# EAGLE design CNC-PowerSwitch-2016-v0.95 (EAGLE 7.7.0)

## Sheet 1 of 3
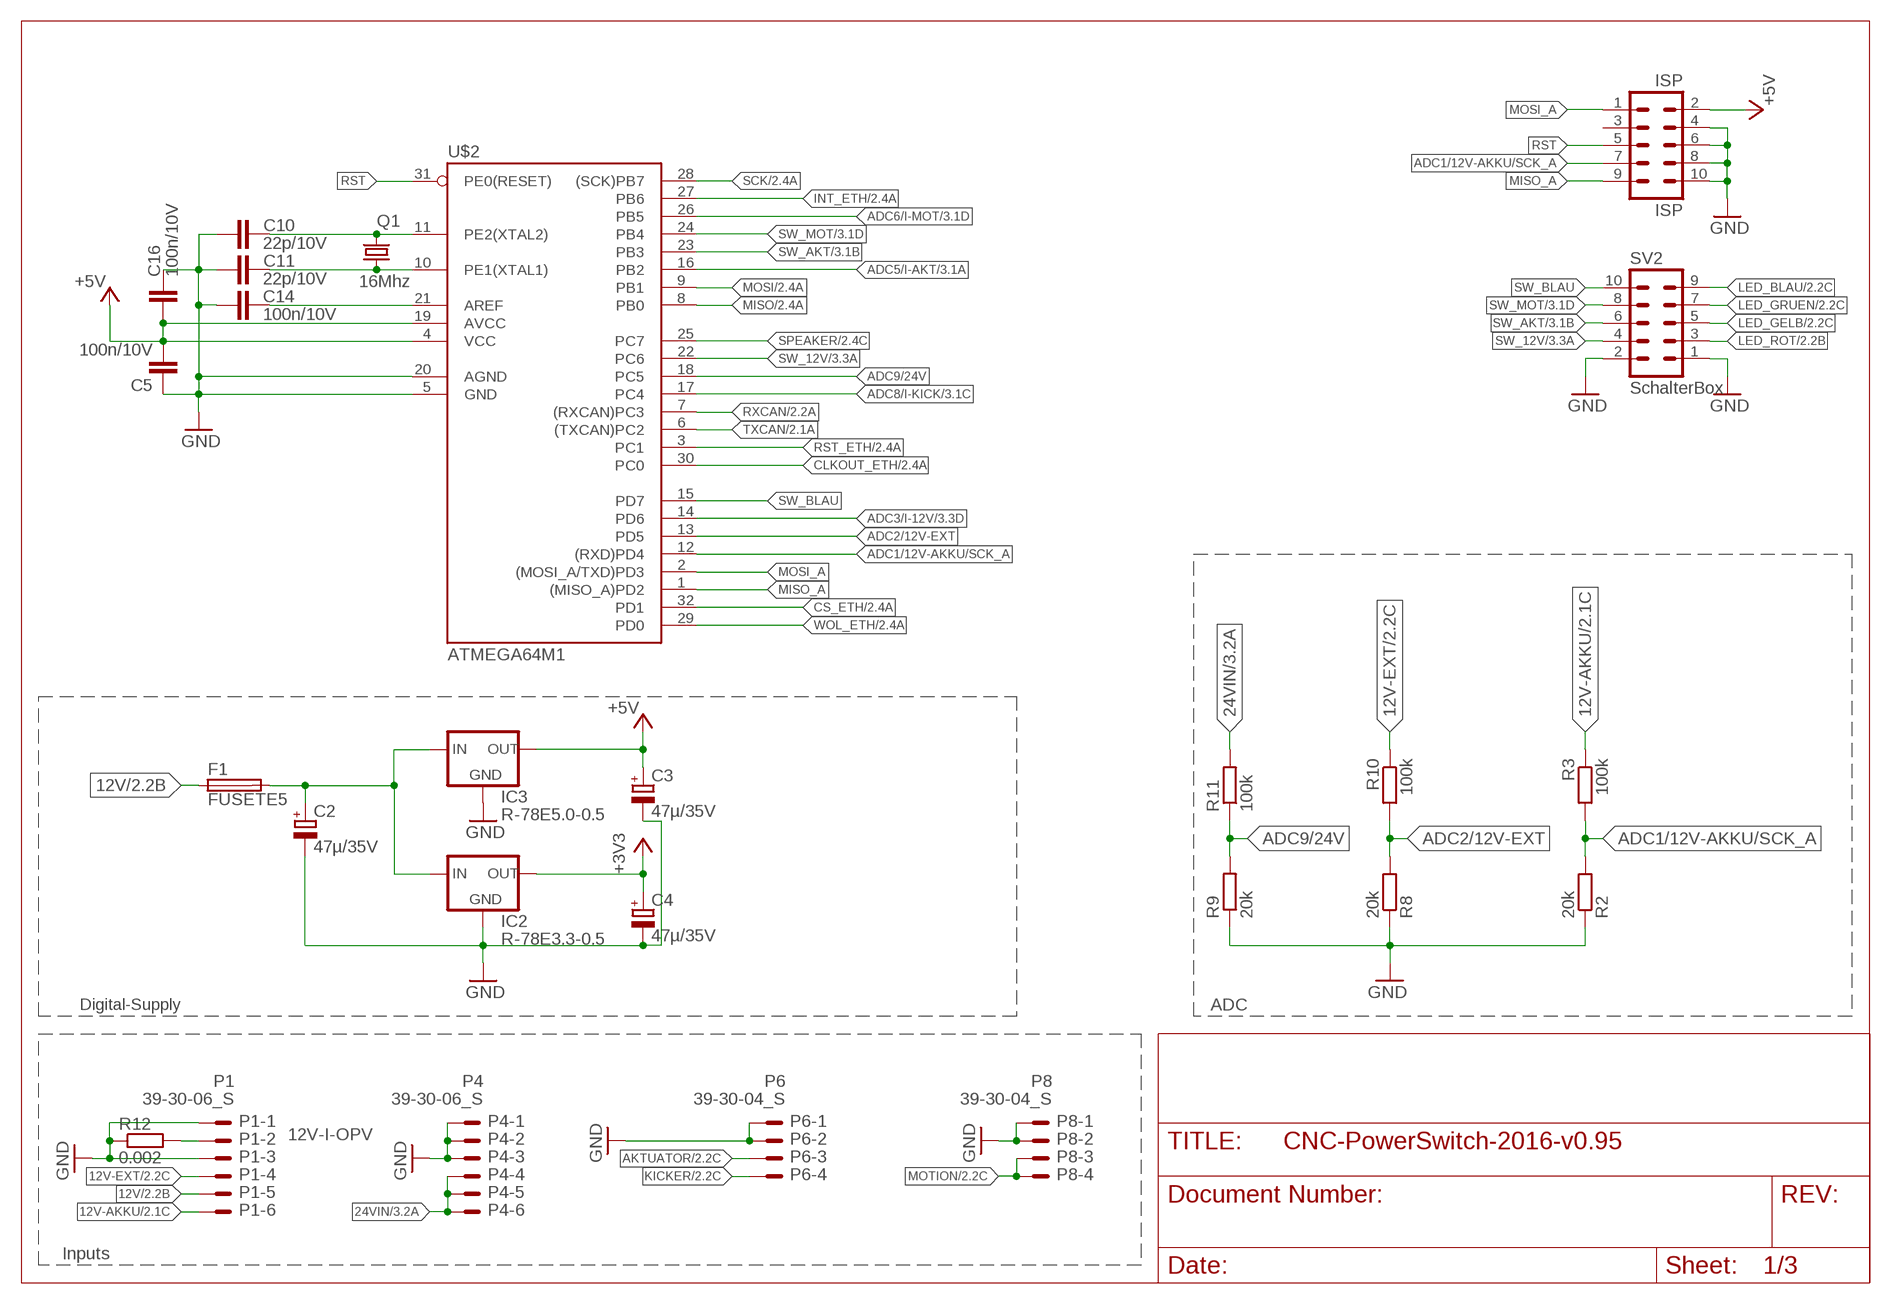
[diagram p0: schematic, sheet 1]

### Parts
C2  47µ/35V  CPOL-EUD  [PANASONIC_D]
C3  47µ/35V  CPOL-EUD  [PANASONIC_D]
C4  47µ/35V  CPOL-EUD  [PANASONIC_D]
C5  100n/10V  C-EUC0603  [C0603]
C10  22p/10V  C-EUC0603  [C0603]
C11  22p/10V  C-EUC0603  [C0603]
C14  100n/10V  C-EUC0603  [C0603]
C16  100n/10V  C-EUC0603  [C0603]
F1  FUSETE5  [TE5]
IC2  R-78E3.3-0.5  [SIP3]
IC3  R-78E5.0-0.5  [SIP3]
ISP  ISP  ML10  [ML10]
P1  39-30-06_S  [39-30-?06?]
P4  39-30-06_S  [39-30-?06?]
P6  39-30-04_S  [39-30-?04?]
P8  39-30-04_S  [39-30-?04?]
Q1  16Mhz  CRYSTALHC49UP  [HC49UP]
R2  20k  R-EU_R0805  [R0805]
R3  100k  R-EU_R0805  [R0805]
R8  20k  R-EU_R0805  [R0805]
R9  20k  R-EU_R0805  [R0805]
R10  100k  R-EU_R0805  [R0805]
R11  100k  R-EU_R0805  [R0805]
R12  0.002  R-EU_R2512  [R2512]
SV2  SchalterBox  ML10L  [ML10L]
U$2  ATMEGA64M1  [TQFP32-08]

### Nets
12V: F1.1 P1.5 ; also sheet 2,3
12V-AKKU: P1.6 R3.1 ; also sheet 2,3
12V-EXT: P1.4 R10.1 ; also sheet 2,3
12V-I-OPV: P1.2 R12.2 ; also sheet 3
24VIN: P4.4 P4.5 P4.6 R11.2 ; also sheet 3
+3V3: C4.+ IC2.3(OUT) ; also sheet 2
+5V: C3.+ C5.2 C16.1 IC3.3(OUT) ISP.2 U$2.4(VCC) U$2.19(AVCC) ; also sheet 2,3
ADC1/12V-AKKU/SCK_A: ISP.7 R2.2 R3.2 U$2.12((RXD)PD4)
ADC2/12V-EXT: R8.2 R10.2 U$2.13(PD5)
ADC3/I-12V: U$2.14(PD6) ; also sheet 3
ADC5/I-AKT: U$2.16(PB2) ; also sheet 3
ADC6/I-MOT: U$2.26(PB5) ; also sheet 3
ADC8/I-KICK: U$2.17(PC4) ; also sheet 3
ADC9/24V: R9.2 R11.1 U$2.18(PC5)
AKTUATOR: P6.3 ; also sheet 2,3
CLKOUT_ETH: U$2.30(PC0) ; also sheet 2
CS_ETH: U$2.32(PD1) ; also sheet 2
GND: C2.- C3.- C4.- C5.1 C10.1 C11.1 C14.1 C16.2 IC2.2(GND) IC3.2(GND) ISP.4 ISP.6 ISP.8 ISP.10 P1.1 P1.3 P4.1 P4.2 P4.3 P6.1 P6.2 P8.1 P8.2 R2.1 R8.1 R9.1 R12.1 SV2.1 SV2.2 U$2.5(GND) U$2.20(AGND) ; also sheet 2,3
INT_ETH: U$2.27(PB6) ; also sheet 2
KICKER: P6.4 ; also sheet 2,3
LED_BLAU: SV2.9 ; also sheet 2
LED_GELB: SV2.5 ; also sheet 2
LED_GRUEN: SV2.7 ; also sheet 2
LED_ROT: SV2.3 ; also sheet 2
MISO: U$2.8(PB0) ; also sheet 2
MISO_A: ISP.9 U$2.1((MISO_A)PD2)
MOSI: U$2.9(PB1) ; also sheet 2
MOSI_A: ISP.1 U$2.2((MOSI_A/TXD)PD3)
MOTION: P8.3 P8.4 ; also sheet 2,3
N$10: C10.2 Q1.2 U$2.11(PE2(XTAL2))
N$11: C11.2 Q1.1 U$2.10(PE1(XTAL1))
N$13: C14.2 U$2.21(AREF)
N$22: C2.+ F1.2 IC2.1(IN) IC3.1(IN)
RST: ISP.5 U$2.31(PE0(RESET))
RST_ETH: U$2.3(PC1) ; also sheet 2
RXCAN: U$2.7((RXCAN)PC3) ; also sheet 2
SCK: U$2.28((SCK)PB7) ; also sheet 2
SPEAKER: U$2.25(PC7) ; also sheet 2
SW_12V: SV2.4 U$2.22(PC6) ; also sheet 3
SW_AKT: SV2.6 U$2.23(PB3) ; also sheet 3
SW_BLAU: SV2.10 U$2.15(PD7)
SW_MOT: SV2.8 U$2.24(PB4) ; also sheet 3
TXCAN: U$2.6((TXCAN)PC2) ; also sheet 2
WOL_ETH: U$2.29(PD0) ; also sheet 2
Unconnected: ISP.3

### Notes on the sheet
- Digital-Supply | ADC
- Inputs

## Sheet 2 of 3
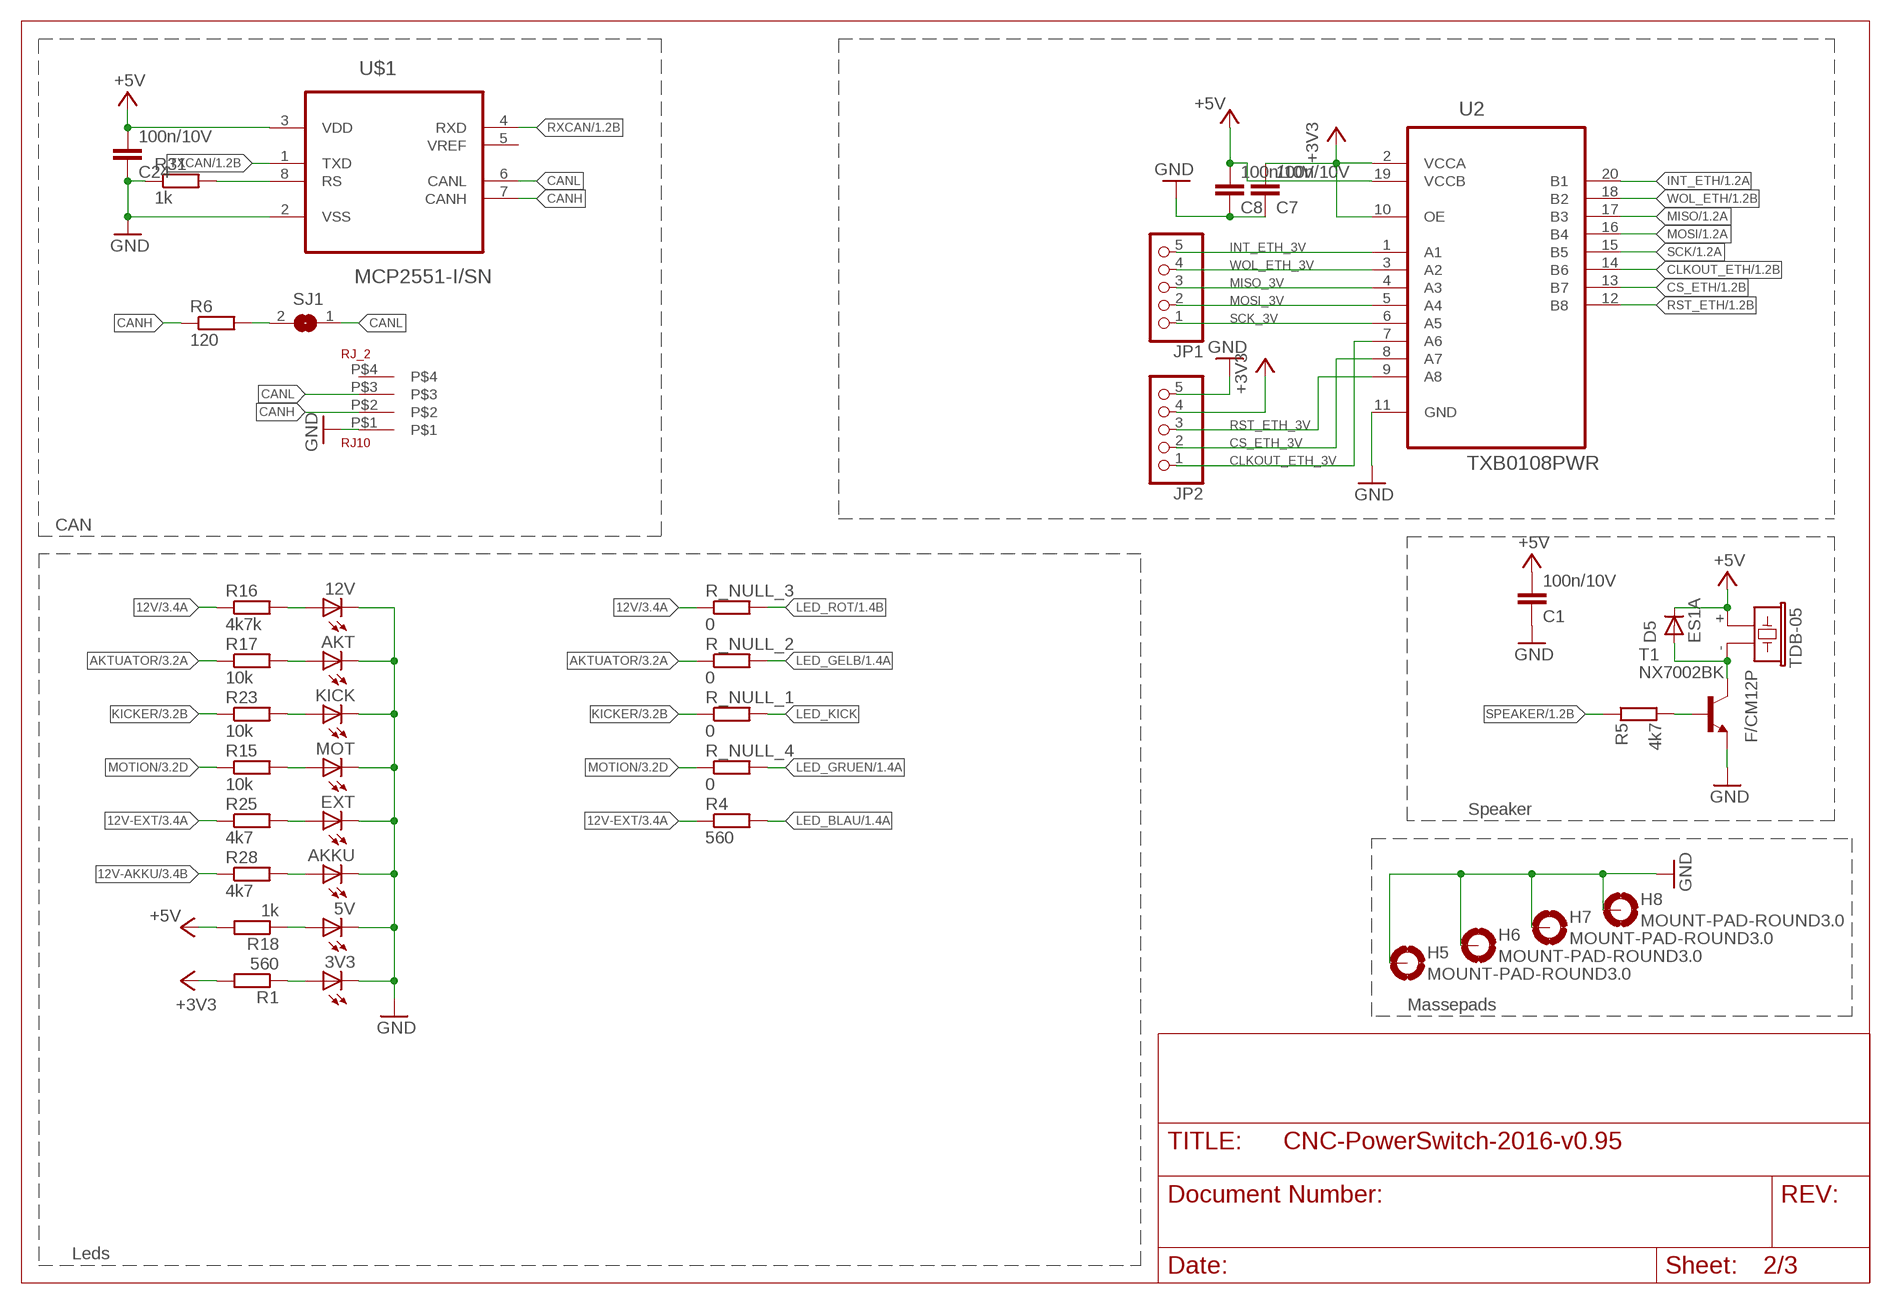
[diagram p1: schematic, sheet 2]

### Parts
3V3  LEDCHIPLED_0805  [CHIPLED_0805]
5V  LEDCHIPLED_0805  [CHIPLED_0805]
12V  LEDCHIPLED_0805  [CHIPLED_0805]
AKKU  LEDCHIPLED_0805  [CHIPLED_0805]
AKT  LEDCHIPLED_0805  [CHIPLED_0805]
C1  100n/10V  C-EUC0603  [C0603]
C7  100n/10V  C-EUC0603  [C0603]
C8  100n/10V  C-EUC0603  [C0603]
C24  100n/10V  C-EUC0603  [C0603]
D5  ES1A  GF1  [SMA-DO214AC]
EXT  LEDCHIPLED_0805  [CHIPLED_0805]
H5  MOUNT-PAD-ROUND3.0  [3,0-PAD]
H6  MOUNT-PAD-ROUND3.0  [3,0-PAD]
H7  MOUNT-PAD-ROUND3.0  [3,0-PAD]
H8  MOUNT-PAD-ROUND3.0  [3,0-PAD]
JP1  PINHD-1X5  [1X05]
JP2  PINHD-1X5  [1X05]
KICK  LEDCHIPLED_0805  [CHIPLED_0805]
MOT  LEDCHIPLED_0805  [CHIPLED_0805]
R1  560  R-EU_R0805  [R0805]
R4  560  R-EU_R0805  [R0805]
R5  4k7  R-EU_R0805  [R0805]
R6  120  R-EU_M0805  [M0805]
R15  10k  R-EU_R0805  [R0805]
R16  4k7k  R-EU_R0805  [R0805]
R17  10k  R-EU_R0805  [R0805]
R18  1k  R-EU_R0805  [R0805]
R23  10k  R-EU_R0805  [R0805]
R25  4k7  R-EU_R0805  [R0805]
R28  4k7  R-EU_R0805  [R0805]
R31  1k  R-EU_R0805  [R0805]
R_NULL_1  0  R-EU_R0402  [R0402]
R_NULL_2  0  R-EU_R0402  [R0402]
R_NULL_3  0  R-EU_R0402  [R0402]
R_NULL_4  0  R-EU_R0402  [R0402]
RJ_2  RJ10  [RJ10]
SJ1  SJ  [SJ]
T1  NX7002BK  BC849  [SOT23]
TDB-05  F/CM12P  [F/CM12P]
U2  TXB0108PWR  [SOP65P640X120-20N]
U$1  MCP2551-I/SN  [SOIC127P600X175-8N]

### Nets
12V: R16.1 R_NULL_3.1 ; also sheet 1,3
12V-AKKU: R28.1 ; also sheet 1,3
12V-EXT: R4.1 R25.1 ; also sheet 1,3
+3V3: C7.2 JP2.4 R1.2 U2.2(VCCA) U2.10(OE) ; also sheet 1
+5V: C1.2 C8.2 C24.2 D5.K(C) R18.2 TDB-05.+ U2.19(VCCB) U$1.3(VDD) ; also sheet 1,3
AKTUATOR: R17.1 R_NULL_2.1 ; also sheet 1,3
CANH: R6.1 RJ_2.P$2 U$1.7(CANH)
CANL: RJ_2.P$3 SJ1.1 U$1.6(CANL)
CLKOUT_ETH: U2.14(B6) ; also sheet 1
CLKOUT_ETH_3V: JP2.1 U2.7(A6)
CS_ETH: U2.13(B7) ; also sheet 1
CS_ETH_3V: JP2.2 U2.8(A7)
GND: 3V3.C 5V.C 12V.C AKKU.C AKT.C C1.1 C7.1 C8.1 C24.1 EXT.C H5.B3,0(MOUNT) H6.B3,0(MOUNT) H7.B3,0(MOUNT) H8.B3,0(MOUNT) JP2.5 KICK.C MOT.C R31.1 RJ_2.P$1 T1.2(E) U2.11(GND) U$1.2(VSS) ; also sheet 1,3
INT_ETH: U2.20(B1) ; also sheet 1
INT_ETH_3V: JP1.5 U2.1(A1)
KICKER: R23.1 R_NULL_1.1 ; also sheet 1,3
LED_BLAU: R4.2 ; also sheet 1
LED_GELB: R_NULL_2.2 ; also sheet 1
LED_GRUEN: R_NULL_4.2 ; also sheet 1
LED_KICK: R_NULL_1.2
LED_ROT: R_NULL_3.2 ; also sheet 1
MISO: U2.17(B3) ; also sheet 1
MISO_3V: JP1.3 U2.4(A3)
MOSI: U2.16(B4) ; also sheet 1
MOSI_3V: JP1.2 U2.5(A4)
MOTION: R15.1 R_NULL_4.1 ; also sheet 1,3
N$1: R5.2 T1.1(B)
N$3: EXT.A R25.2
N$4: KICK.A R23.2
N$5: 3V3.A R1.1
N$6: R31.2 U$1.8(RS)
N$7: R6.2 SJ1.2
N$20: D5.A T1.3(C) TDB-05.-
N$24: AKKU.A R28.2
N$102: 12V.A R16.2
N$104: AKT.A R17.2
N$106: MOT.A R15.2
N$108: 5V.A R18.1
RST_ETH: U2.12(B8) ; also sheet 1
RST_ETH_3V: JP2.3 U2.9(A8)
RXCAN: U$1.4(RXD) ; also sheet 1
SCK: U2.15(B5) ; also sheet 1
SCK_3V: JP1.1 U2.6(A5)
SPEAKER: R5.1 ; also sheet 1
TXCAN: U$1.1(TXD) ; also sheet 1
WOL_ETH: U2.18(B2) ; also sheet 1
WOL_ETH_3V: JP1.4 U2.3(A2)
Unconnected: RJ_2.P$4 U$1.5(VREF)

### Notes on the sheet
- CAN
- Speaker
- Massepads
- Leds

## Sheet 3 of 3
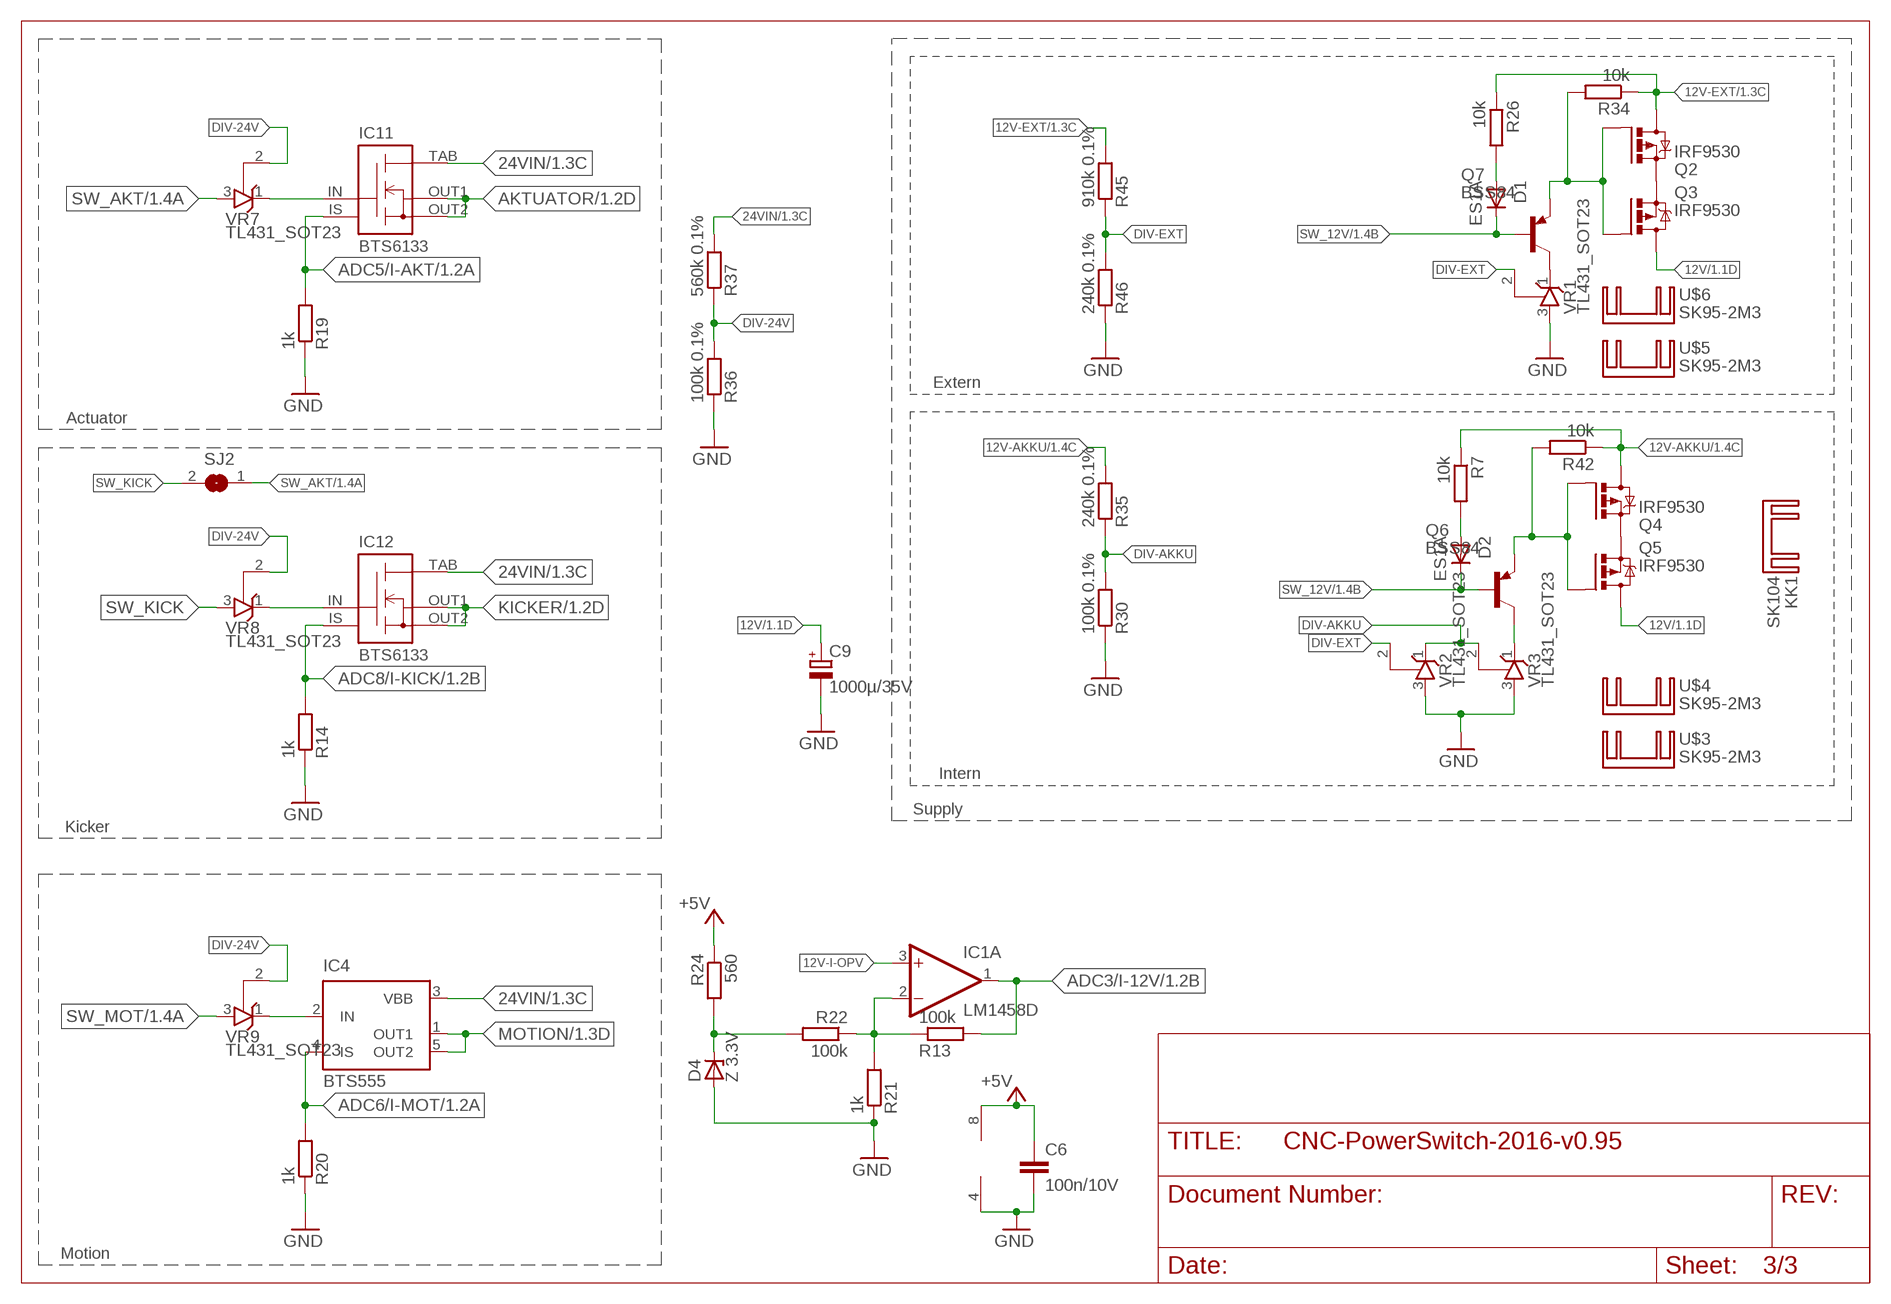
[diagram p2: schematic, sheet 3]

### Parts
C6  100n/10V  C-EUC0603  [C0603]
C9  1000µ/35V  CPOL-EUE5-10.5  [E5-10,5]
D1  ES1A  GF1  [SMA-DO214AC]
D2  ES1A  GF1  [SMA-DO214AC]
D4  Z 3.3V  ZENER-DIODESOT23  [SOT23]
IC1  LM1458D  [SO08]
IC4  BTS555  [TO220-51]
IC11  BTS6133  [TO252-51]
IC12  BTS6133  [TO252-51]
KK1  SK104  [SK104]
Q2  IRF9530  [TO220BV]
Q3  IRF9530  [TO220BV]
Q4  IRF9530  [TO220BV]
Q5  IRF9530  [TO220BV]
Q6  BSS84  BC858ALT1SMD  [SOT23-BEC]
Q7  BSS84  BC858ALT1SMD  [SOT23-BEC]
R7  10k  R-EU_R0805  [R0805]
R13  100k  R-EU_R0805  [R0805]
R14  1k  R-EU_R0805  [R0805]
R19  1k  R-EU_R0805  [R0805]
R20  1k  R-EU_R0805  [R0805]
R21  1k  R-EU_R0805  [R0805]
R22  100k  R-EU_R0805  [R0805]
R24  560  R-EU_R0805  [R0805]
R26  10k  R-EU_R0805  [R0805]
R30  100k 0.1%  R-EU_R0805  [R0805]
R34  10k  R-EU_R0805  [R0805]
R35  240k 0.1%  R-EU_R0805  [R0805]
R36  100k 0.1%  R-EU_R0805  [R0805]
R37  560k 0.1%  R-EU_R0805  [R0805]
R42  10k  R-EU_R0805  [R0805]
R45  910k 0.1%  R-EU_R0805  [R0805]
R46  240k 0.1%  R-EU_R0805  [R0805]
SJ2  SJ  [SJ]
U$3  SK95-2M3  [SK95-2M3]
U$4  SK95-2M3  [SK95-2M3]
U$5  SK95-2M3  [SK95-2M3]
U$6  SK95-2M3  [SK95-2M3]
VR1  TL431_SOT23  [SOT23]
VR2  TL431_SOT23  [SOT23]
VR3  TL431_SOT23  [SOT23]
VR7  TL431_SOT23  [SOT23]
VR8  TL431_SOT23  [SOT23]
VR9  TL431_SOT23  [SOT23]

### Nets
12V: C9.+ Q3.D Q5.D ; also sheet 1,2
12V-AKKU: Q4.D R7.1 R35.2 R42.1 ; also sheet 1,2
12V-EXT: Q2.D R26.1 R34.1 R45.2 ; also sheet 1,2
12V-I-OPV: IC1.3(A:+IN) ; also sheet 1
24VIN: IC4.3(VBB) IC11.TAB(VBB) IC12.TAB(VBB) R37.2 ; also sheet 1
+5V: C6.1 IC1.8(P:V+) R24.1 ; also sheet 1,2
ADC3/I-12V: IC1.1(A:OUT) R13.2 ; also sheet 1
ADC5/I-AKT: IC11.IS R19.2 ; also sheet 1
ADC6/I-MOT: IC4.4(IS) R20.2 ; also sheet 1
ADC8/I-KICK: IC12.IS R14.2 ; also sheet 1
AKTUATOR: IC11.OUT1(OUT) IC11.OUT2(OUT) ; also sheet 1,2
DIV-24V: R36.2 R37.1 VR7.2(R) VR8.2(R) VR9.2(R)
DIV-AKKU: R30.2 R35.1 VR2.1(C) VR3.2(R)
DIV-EXT: R45.1 R46.2 VR1.2(R) VR2.2(R)
GND: C6.2 C9.- D4.1(A) IC1.4(P:V-) R14.1 R19.1 R20.1 R21.1 R30.1 R36.1 R46.1 VR1.3(A) VR2.3(A) VR3.3(A) ; also sheet 1,2
KICKER: IC12.OUT1(OUT) IC12.OUT2(OUT) ; also sheet 1,2
MOTION: IC4.1(OUT1) IC4.5(OUT2) ; also sheet 1,2
N$2: Q7.C VR1.1(C)
N$8: Q6.C VR3.1(C)
N$9: D2.A R7.2
N$12: D1.A R26.2
N$25: IC1.2(A:-IN) R13.1 R21.2 R22.1
N$26: D4.3(C) R22.2 R24.2
N$28: Q2.S Q3.S
N$30: Q4.G Q5.G Q6.E R42.2
N$31: Q4.S Q5.S
N$36: IC12.IN VR8.1(C)
N$37: IC4.2(IN) VR9.1(C)
N$40: IC11.IN VR7.1(C)
N$49: Q2.G Q3.G Q7.E R34.2
SW_12V: D1.K(C) D2.K(C) Q6.B Q7.B ; also sheet 1
SW_AKT: SJ2.1 VR7.3(A) ; also sheet 1
SW_KICK: SJ2.2 VR8.3(A)
SW_MOT: VR9.3(A) ; also sheet 1
Unconnected: IC1.5(B:+IN) IC1.6(B:-IN) IC1.7(B:OUT)

### Notes on the sheet
- Extern
- Actuator
- Intern
- Supply
- Kicker
- Motion

## Library data of the parts
3V3 5V 12V AKKU AKT EXT KICK MOT = led:LED: LED OSRAM: - CHIPLED LG R971, LG N971, LY N971, LG Q971, LY Q971, LO R971, LY R971 LH N974, LH R974 LS Q976, LO Q976, LY Q976 LO Q996 - Hyper CHIPLED LW Q18S LB Q993, LB Q99A, LB R99A - SideLED LS A670, LO A670, LY A670, LG A670, LP A670 LB A673, LV A673, LT A673, LW A673 LH A674 LY A675 LS A676, LA A676, LO A676, LY A676, LW A676 LS A679, LY A679, LG A679 - Hyper Micro SIDELED® LS Y876, LA Y876, LO Y876, LY Y876 LT Y87S - SmartLED LW L88C, LW L88S LB L89C, LB L89S, LG L890 LS L89K, LO L89K, LY L89K LS L896, LA L896, LO L896, LY L896 - TOPLED LS T670, LO T670, LY T670, LG T670, LP T670 LSG T670, LSP T670, LSY T670, LOP T670, LYG T670 LG T671, LOG T671, LSG T671 LB T673, LV T673, LT T673, LW T673 LH T674 LS T676, LA T676, LO T676, LY T676, LB T676, LH T676, LSB T676, LW T676 LB T67C, LV T67C, LT T67C, LS T67K, LO T67K, LY T67K, LW E67C LS E67B, LA E67B, LO E67B, LY E67B, LB E67C, LV E67C, LT E67C LW T67C LS T679, LY T679, LG T679 LS T770, LO T770, LY T770, LG T770, LP T770 LB T773, LV T773, LT T773, LW T773 LH T774 LS E675, LA E675, LY E675, LS T675 LS T776, LA T776, LO T776, LY T776, LB T776 LHGB T686 LT T68C, LB T68C - Hyper Mini TOPLED® LB M676 - Mini TOPLED Santana® LG M470 LS M47K, LO M47K, LY M47K Source: http://www.osram.convergy.de LUXEON: - LUMILED® LXK2-PW12-R00, LXK2-PW12-S00, LXK2-PW14-U00, LXK2-PW14-V00 LXK2-PM12-R00, LXK2-PM12-S00, LXK2-PM14-U00 LXK2-PE12-Q00, LXK2-PE12-R00, LXK2-PE12-S00, LXK2-PE14-T00, LXK2-PE14-U00 LXK2-PB12-K00, LXK2-PB12-L00, LXK2-PB12-M00, LXK2-PB14-N00, LXK2-PB14-P00, LXK2-PB14-Q00 LXK2-PR12-L00, LXK2-PR12-M00, LXK2-PR14-Q00, LXK2-PR14-R00 LXK2-PD12-Q00, LXK2-PD12-R00, LXK2-PD12-S00 LXK2-PH12-R00, LXK2-PH12-S00 LXK2-PL12-P00, LXK2-PL12-Q00, LXK2-PL12-R00 Source: www.luxeon.com KINGBRIGHT: KA-3528ASYC Source: www.kingbright.com
C1 C5-C8 C10 C11 C14 C16 C24 = rcl:C-EU: CAPACITOR, European symbol
C2-C4 C9 = rcl:CPOL-EU: POLARIZED CAPACITOR, European symbol
D1 D2 D5 = diode:GF1: DIODE
D4 = diode:ZENER-DIODE: Z-Diode
F1 = fuse:FUSE: Fuse; OC_FARNELL: unknown; OC_NEWARK: unknown
H5-H8 = holes:MOUNT-PAD-ROUND: MOUNTING PAD, round
IC1 = linear:*1458: OP AMP
IC2 = r-78xx_10:R-78E*-0.5: Innoline R-78xx-0.5 Series Switching Regulators - 0.5A, Low Cost Source: http://www.recom-international.com/pdf/Innoline/R-78Exx-0.5.pdf; MF: Recom; MPN: R-783.3-0.5; OC_FARNELL: unknown; OC_NEWARK: 62X9498
IC3 = r-78xx_10:R-78E*-0.5: Innoline R-78xx-0.5 Series Switching Regulators - 0.5A, Low Cost Source: http://www.recom-international.com/pdf/Innoline/R-78Exx-0.5.pdf; MF: Recom; MPN: R-785.0-0.5; OC_FARNELL: 2078564; OC_NEWARK: 62X9499
IC4 = micro-siemens:BTS555: Smart Highside High Current Power Switch PROFET® Source: http://www.infineon.com/upload/Document/cmc_upload/documents/011/8726/Datasheet_BTS555.pdf; MF: FARNELL; MPN: BTS555.; OC_FARNELL: 4109260; OC_NEWARK: 26H6766
IC11 IC12 = BTS443P:BTS6133
ISP = con-ml:ML10: HARTING; OC_FARNELL: unknown; OC_NEWARK: unknown
JP1 JP2 = pinhead:PINHD-1X5: PIN HEADER
KK1 = modifiedHeatsinks:SK104: HEATSINK manufacturer Fischer/distributor Buerklin
P1 P4 = con-molex-mini-fit:39-30-?06?_S: HEADER
P6 P8 = con-molex-mini-fit:39-30-?04?_S: HEADER
Q1 = crystal:CRYSTAL: CRYSTAL; OC_FARNELL: unknown; OC_NEWARK: unknown
Q2-Q5 = transistor-power:IRF9530: P-CHANNEL HEXFET POWER-MOS-FET Source: http://www.irf.com/product-info/datasheets/data/irf9530.pdf
Q6 Q7 = transistor-pnp:BC858*: PNP Transistror
R1-R26 R28 R30 R31 R34-R37 R42 R45 R46 R_NULL_1-R_NULL_4 = rcl:R-EU_: RESISTOR, European symbol
RJ_2 = ownParts:RJ10
SJ1 SJ2 = jumper:SJ: SMD solder JUMPER
SV2 = con-ml:ML10L: HARTING; OC_FARNELL: unknown; OC_NEWARK: unknown
T1 = transistor:BC849: NPN TRANSISTOR
TDB-05 = buzzer:F/CM12P: BUZZER Source: Buerklin; OC_FARNELL: unknown; OC_NEWARK: unknown
U2 = TI-TXB0108PWR:TXB0108PWR: 8-BIT BIDIRECTIONAL VOLTAGE-LEVEL TRANSLATOR; MPN: TXB0108PWR; OC_FARNELL: 1494945; OC_NEWARK: 27M1151; PACKAGE: TSSOP-20; SUPPLIER: Texas Instruments
U$1 = Microchip-MCP2551-I_SN:MCP2551-I/SN: High-Speed CAN Transceiver; MPN: MCP2551-I/SN; OC_FARNELL: 9758569; OC_NEWARK: 69K7604; PACKAGE: SOIC-8; SUPPLIER: Microchip
U$2 = atmega16m1-32m1-64m1:ATMEGA64M1
U$3-U$6 = modifiedHeatsinks:SK95-2M3
VR1-VR3 VR7-VR9 = 1_USER:TL431

## Board
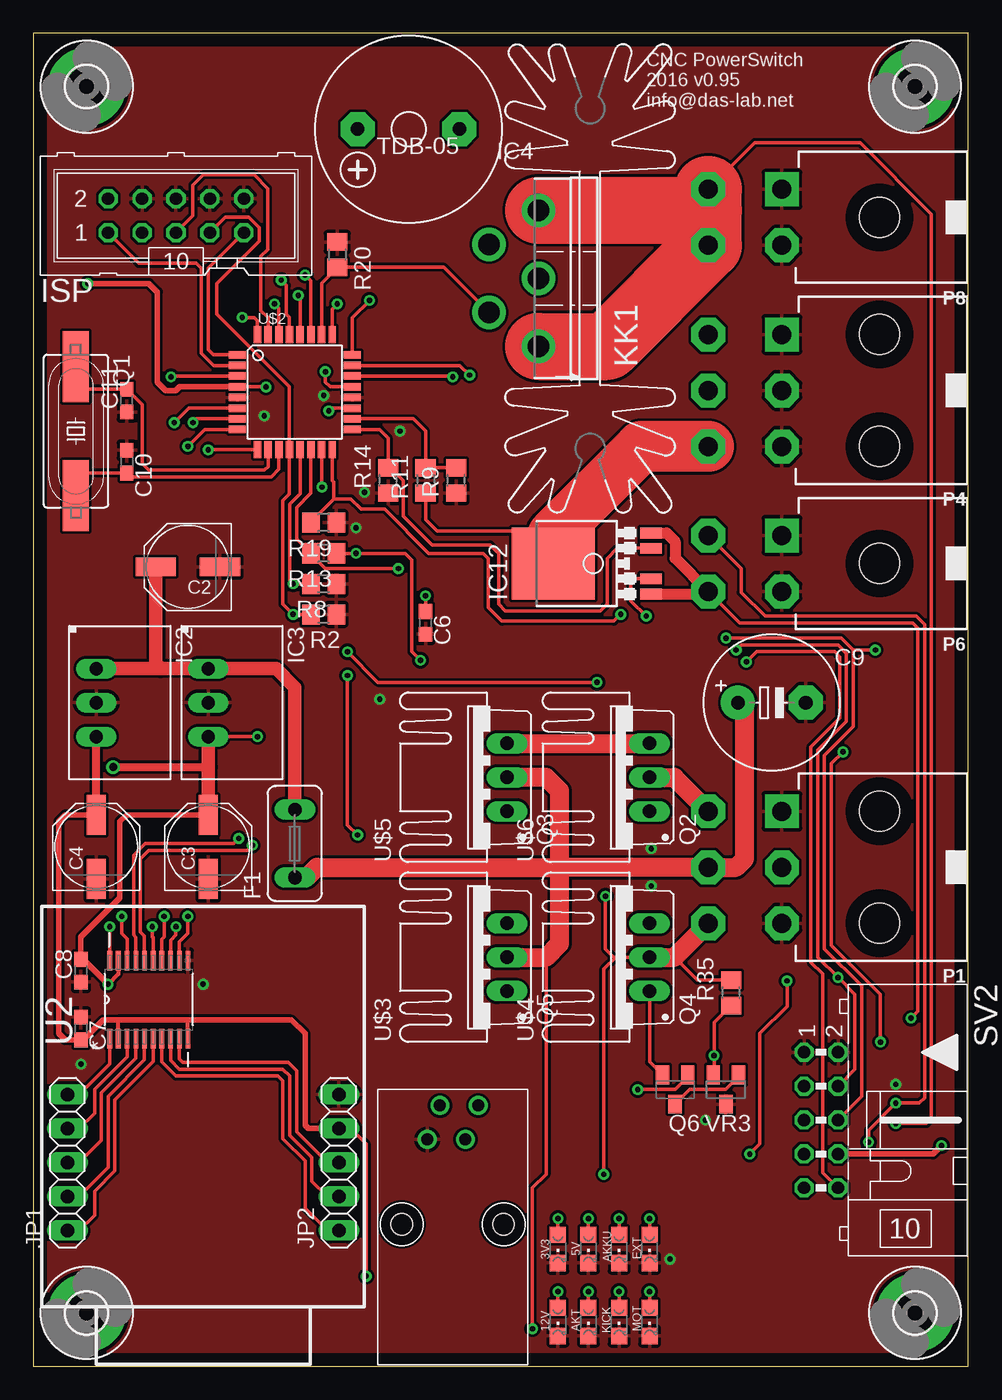
[diagram p3: board, top side]
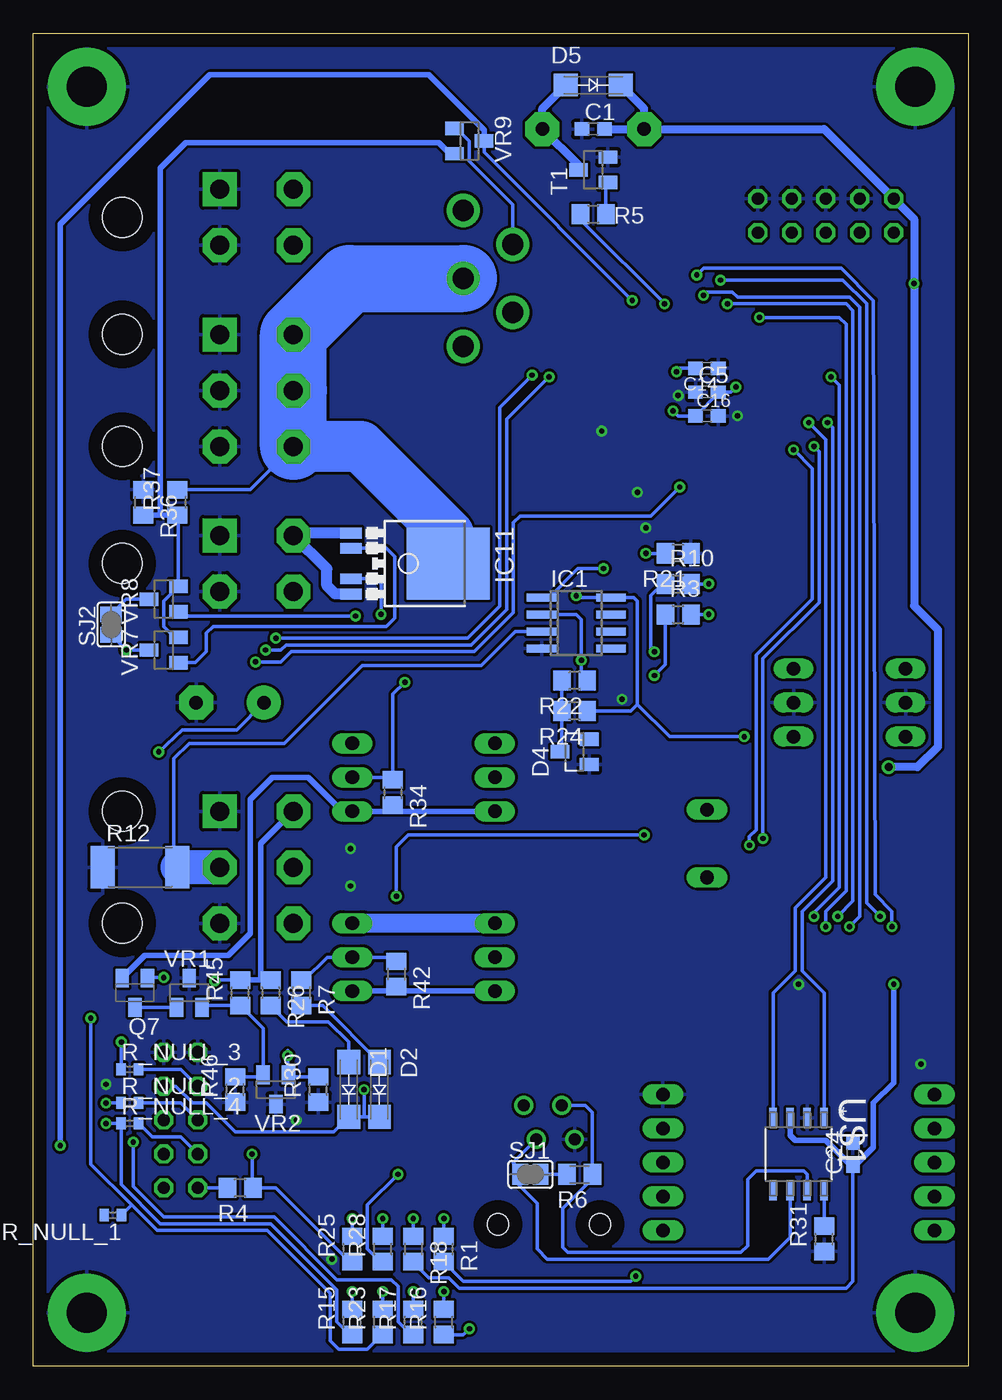
[diagram p4: board, bottom side, seen from below]

Size 69.95 x 99.75 mm. Coordinates in mm from the lower left corner, seen from the top.
Outline: 0,0 69.95,0 69.95,99.75 0,99.75 0,0
Copper layers (1*16): Top 0.035mm / dielectric 1.5mm / Bottom 0.035mm
Design rules "8mils": minimum track width 8mil, minimum drill 0.6mm, track to track 8mil, track to pad 8mil, pad to pad 8mil, via to via 8mil, smd to smd 8mil, copper to edge 40mil, drill to drill 10mil, minimum pad ring 10mil, minimum via ring 8mil, stop-mask expansion 0mil, vias tented up to drill 0mil, thermal gap 10mil

### Footprints (pad centres in the part's own frame; a part is rotated, then mirrored left to right if it is on the bottom)
CHIPLED_0805 = smd 1.2 x 1.2: A 0,-1.05; C 0,1.05
C0603 = smd 1.1 x 1: 1 -0.85,0; 2 0.85,0
PANASONIC_D = smd 3 x 1.4: + 2.4,0; - -2.4,0
E5-10,5 = drill 1.016 pad 2.54: + -2.54,0 | drill 1.016 pad 2.54 octagon: - 2.54,0
SMA-DO214AC = smd 1.8 x 1.7: A -2.05,0; K 2.05,0
SOT23 = smd 1 x 1.4: 1 -0.95,-1.1; 2 0.95,-1.1; 3 0,1.1
TE5 = drill 1.016 long: 1 -2.54,0; 2 2.54,0
3,0-PAD = drill 3 pad 5.842: B3,0 0,0
SO08 = smd 0.6 x 2.2: 1 -1.905,-2.6; 2 -0.635,-2.6; 3 0.635,-2.6; 4 1.905,-2.6; 5 1.905,2.6; 6 0.635,2.6; 7 -0.635,2.6; 8 -1.905,2.6
SIP3 = drill 1 long: 1 -2.54,0; 2 0,0; 3 2.54,0
TO220-51 = drill 1.6 pad 2.5: 1 -5.1,-4.5; 2 -2.55,-8.2; 3 0,-4.5; 4 2.55,-8.2; 5 5.1,-4.5
TO252-51 = smd 0.8 x 1.6: IN -1.14,-4.8; IS 1.14,-4.8; OUT1 -2.28,-4.8; OUT2 2.28,-4.8 | smd 5.4 x 6.2: TAB 0,2.5
ML10 = drill 0.914 octagon: 1 -5.08,-1.27; 2 -5.08,1.27; 3 -2.54,-1.27; 4 -2.54,1.27; 5 0,-1.27; 6 0,1.27; 7 2.54,-1.27; 8 2.54,1.27; 9 5.08,-1.27; 10 5.08,1.27
1X05 = drill 1.016 long: 1 -5.08,0; 2 -2.54,0; 3 0,0; 4 2.54,0; 5 5.08,0
39-30-?06? = drill 1.422 pad 2.54 square: 1 4.191,0 | drill 1.422 pad 2.54 octagon: 2 0,0; 3 -4.191,0; 4 4.191,5.512; 5 0,5.512; 6 -4.191,5.512 | hole 3: -4.191,-7.3; 4.191,-7.3
39-30-?04? = drill 1.422 pad 2.54 square: 1 2.095,0 | drill 1.422 pad 2.54 octagon: 2 -2.095,0; 3 2.095,5.512; 4 -2.095,5.512 | hole 3: 0,-7.3
HC49UP = smd 5.334 x 1.93: 1 -4.826,0; 2 4.826,0
TO220BV = drill 1.016 long: D 0,-2.54; G -2.54,-2.54; S 2.54,-2.54
SOT23-BEC = smd 1 x 1.4: B -0.95,-1.1; C 0,1.1; E 0.95,-1.1
R0805 = smd 1.3 x 1.5: 1 -0.95,0; 2 0.95,0
M0805 = smd 1.3 x 1.6: 1 -0.95,0; 2 0.95,0
R2512 = smd 1.8 x 3.2: 1 -2.8,0; 2 2.8,0
R0402 = smd 0.7 x 0.9: 1 -0.65,0; 2 0.65,0
RJ10 = drill 0.9: P$1 -1.905,6.55; P$2 -0.953,9.09; P$3 0.953,6.55; P$4 1.905,9.09 | hole 1.59: -3.81,0.2; 3.81,0.2
SJ = smd 1.168 x 1.6: 1 -0.762,0; 2 0.762,0
ML10L = drill 0.914 octagon: 1 -5.08,-1.27; 2 -5.08,1.27; 3 -2.54,-1.27; 4 -2.54,1.27; 5 0,-1.27; 6 0,1.27; 7 2.54,-1.27; 8 2.54,1.27; 9 5.08,-1.27; 10 5.08,1.27
F/CM12P = drill 1.016 pad 2.54 octagon: + 3.81,0; - -3.81,0
SOP65P640X120-20N = smd 1.473 x 0.356: 1 -2.921,2.921; 2 -2.921,2.286; 3 -2.921,1.626; 4 -2.921,0.965; 5 -2.921,0.33; 6 -2.921,-0.33; 7 -2.921,-0.965; 8 -2.921,-1.626; 9 -2.921,-2.286; 10 -2.921,-2.921; 11 2.921,-2.921; 12 2.921,-2.286; 13 2.921,-1.626; 14 2.921,-0.965; 15 2.921,-0.33; 16 2.921,0.33; 17 2.921,0.965; 18 2.921,1.626; 19 2.921,2.286; 20 2.921,2.921
SOIC127P600X175-8N = smd 1.473 x 0.559: 1 -2.718,1.905; 2 -2.718,0.635; 3 -2.718,-0.635; 4 -2.718,-1.905; 5 2.718,-1.905; 6 2.718,-0.635; 7 2.718,0.635; 8 2.718,1.905
TQFP32-08 = smd 1.27 x 0.559: 1 -4.293,2.8; 2 -4.293,2; 3 -4.293,1.2; 4 -4.293,0.4; 5 -4.293,-0.4; 6 -4.293,-1.2; 7 -4.293,-2; 8 -4.293,-2.8; 17 4.293,-2.8; 18 4.293,-2; 19 4.293,-1.2; 20 4.293,-0.4; 21 4.293,0.4; 22 4.293,1.2; 23 4.293,2; 24 4.293,2.8 | smd 0.559 x 1.27: 9 -2.8,-4.293; 10 -2,-4.293; 11 -1.2,-4.293; 12 -0.4,-4.293; 13 0.4,-4.293; 14 1.2,-4.293; 15 2,-4.293; 16 2.8,-4.293; 25 2.8,4.293; 26 2,4.293; 27 1.2,4.293; 28 0.4,4.293; 29 -0.4,4.293; 30 -1.2,4.293; 31 -2,4.293; 32 -2.8,4.293

### Placement (x,y rotation side)
3V3  39.24,8.76 180 top
5V  41.53,8.76 180 top
12V  39.24,3.3 180 top
AKKU  43.81,8.76 180 top
AKT  41.53,3.3 180 top
C1  28.07,92.58 0 bottom
C2  11.56,59.82 180 top
C3  13.08,38.86 90 top
C4  4.7,38.86 90 top
C5  19.56,72.9 0 bottom
C6  29.34,55.63 270 top
C7  3.56,25.27 270 top
C8  3.56,29.59 90 top
C9  55.24,49.66 0 top
C10  6.99,67.69 270 top
C11  6.99,72.26 90 top
C14  19.56,74.68 180 bottom
C16  19.56,71.12 0 bottom
C24  8.64,15.88 270 bottom
D1  46.35,20.7 270 bottom
D2  44.07,20.7 270 bottom
D4  29.46,45.97 90 bottom
D5  28.07,95.89 0 bottom
EXT  46.1,8.76 180 top
F1  19.56,39.12 90 top
H5  3.98,95.76 0 top
H6  65.97,95.76 0 top
H7  3.98,3.98 0 top
H8  65.97,3.98 0 top
IC1  29.34,55.63 270 bottom
IC2  4.7,49.66 270 top
IC3  13.08,49.66 270 top
IC4  42.29,81.41 270 top
IC11  41.4,60.07 270 bottom
IC12  41.4,60.07 90 top
ISP  10.67,86.11 0 top
JP1  2.54,15.24 90 top
JP2  22.86,15.24 90 top
KICK  43.81,3.3 180 top
KK1  40.89,81.41 90 top
MOT  46.1,3.3 180 top
P1  39-30-06?_S  [39-30-?06?]  56.01,37.34 90 top
P4  39-30-06?_S  [39-30-?06?]  56.01,73.03 90 top
P6  39-30-04?_S  [39-30-?04?]  56.01,60.07 90 top
P8  39-30-04?_S  [39-30-?04?]  56.01,85.98 90 top
Q1  3.17,69.98 270 top
Q2  43.56,44.07 90 top
Q3  32.89,44.07 90 top
Q4  43.56,30.61 90 top
Q5  32.89,30.61 90 top
Q6  48.01,20.7 180 top
Q7  62.36,27.94 180 bottom
R1  39.24,8.76 270 bottom
R2  21.72,56.26 180 top
R3  21.72,56.26 0 bottom
R4  54.48,13.34 180 bottom
R5  28.07,86.23 0 bottom
R6  29.08,14.35 180 bottom
R7  49.91,27.94 270 bottom
R8  21.72,58.55 180 top
R9  31.62,66.29 90 top
R10  21.72,58.55 0 bottom
R11  29.34,66.29 270 top
R12  61.98,37.34 0 bottom
R13  21.72,60.83 180 top
R14  26.54,66.29 90 top
R15  46.1,3.3 90 bottom
R16  39.24,3.3 90 bottom
R17  41.53,3.3 90 bottom
R18  41.53,8.76 270 bottom
R19  21.72,63.12 180 top
R20  22.73,83.19 270 top
R21  21.72,60.83 180 bottom
R22  29.46,51.31 180 bottom
R23  43.81,3.3 90 bottom
R24  29.46,49.02 180 bottom
R25  46.1,8.76 90 bottom
R26  52.2,27.94 270 bottom
R28  43.81,8.76 90 bottom
R30  48.64,20.7 90 bottom
R31  10.79,9.53 90 bottom
R34  43.05,42.93 270 bottom
R35  52.2,27.94 90 top
R36  61.72,64.64 270 bottom
R37  59.18,64.64 90 bottom
R42  42.8,29.34 270 bottom
R45  54.48,27.94 90 bottom
R46  54.86,20.7 90 bottom
R_NULL_1  64.01,11.3 180 bottom
R_NULL_2  62.74,19.68 0 bottom
R_NULL_3  62.74,22.23 0 bottom
R_NULL_4  62.74,18.16 0 bottom
RJ_2  31.37,10.41 0 top
SJ1  32.77,14.35 0 bottom
SJ2  64.14,55.5 90 bottom
SV2  58.93,18.41 270 top
T1  28.07,89.53 90 bottom
TDB-05  28.07,92.58 180 top
U2  8.64,27.43 90 top
U$1  12.7,15.88 270 bottom
U$2  19.56,72.9 0 top
U$3  32.51,30.61 90 top
U$4  43.18,30.61 90 top
U$5  32.51,44.07 90 top
U$6  43.18,44.07 90 top
VR1  58.29,27.94 0 bottom
VR2  51.82,20.7 180 bottom
VR3  51.82,20.7 180 top
VR7  60.2,53.59 90 bottom
VR8  60.2,57.4 90 bottom
VR9  37.34,91.69 270 bottom

### Tracks (layer width: path | path; a pad name or v marks a point on that pad's centre or on a via)
12V  (via drill 0.4)
  Top 0.254: 38.35,30.61 38.35,14.35 37.34,13.34 v37.34,2.79 | v63.37,24.26 63.37,27.81 59.69,31.5 59.69,45.09 v60.58,45.97
  Top 1.422: F1.1 20.45,36.58 21.21,37.34 39.37,37.34 | 39.37,37.34 39.37,31.62 38.35,30.61 Q5.D | 39.37,37.34 39.37,43.05 38.35,44.07 Q3.D | 39.37,37.34 P1.5 52.58,37.34 53.21,37.97 53.21,49.15 C9.+
  Bottom 0.254: R16.1 37.78,2.35 v37.34,2.79 | R_NULL_3.1 63.39,24.24 v63.37,24.26 | v60.58,45.97 58.8,47.62 54.74,47.62 C9.+
12V-AKKU  (via drill 0.4)
  Top 0.254: R35.2 49.67,28.89 48.23,30.33 46.38,30.33 Q4.D 43.56,30.61 | v23.5,51.69 23.5,40.51 v24.26,39.75 | v42.8,35.18 42.8,31.24 43.43,30.61 43.56,30.61 | v42.67,14.35 42.67,29.72 43.56,30.61
  Top 1.422: Q4.D 47.95,30.61 P1.6
  Bottom 0.254: R42.1 43.12,30.61 Q4.D 47.95,30.61 49.67,28.89 R7.1 | R3.1 22.67,52.52 v23.5,51.69 | v24.26,39.75 41.91,39.75 42.8,38.86 v42.8,35.18 | R28.1 44.01,7.81 44.96,8.76 44.96,12.06 v42.67,14.35
12V-EXT  (via drill 0.4)
  Top 0.254: v42.16,51.18 25.78,51.18 v23.5,53.47 | v56.39,28.83 56.39,26.92 54.36,24.89 54.36,16.64 v53.59,15.88
  Top 1.422: Q2.D 47.95,44.07 P1.4
  Bottom 0.254: Q2.D 43.25,44.07 R34.1 43.05,50.29 v42.16,51.18 | R10.1 22.86,58.55 23.75,57.66 23.75,53.72 v23.5,53.47 | R45.2 56.33,28.89 v56.39,28.83 | v53.59,15.88 53.59,13.4 R4.1 51.82,13.34 46.29,7.81 R25.1
  Bottom 0.406: P1.4 50.55,41.53 52.96,39.12 52.96,29.02 52.83,28.89 | R45.2 52.83,28.89 | 52.83,28.89 R26.1
12V-I-OPV
  Bottom 0.254: IC1.3 33.91,54.99 36.45,52.45 45.34,52.45 51.18,46.61 58.29,46.61 59.44,45.47 59.44,37.59 R12.2
  Bottom 2.54: P1.2 R12.2
24VIN
  Top 0.254: R11.2 29.34,63.37 30.23,62.48 38.69,62.48 38.9,62.27
  Top 3.81: P4.6 45.47,68.83 38.9,62.27 38.86,62.23 38.86,60.11 IC12.TAB
  Bottom 0.254: P4.6 53.74,65.59 R37.2
  Bottom 3.81: IC12.TAB 38.9,62.27 45.47,68.83 P4.6
  Bottom 5: IC4.3 46.3,81.41 P4.4 P4.5 P4.6
+3V3  (via drill 0.4)
  Top 0.254: JP2.4 23.75,17.78 24.89,16.64 v24.89,6.73
  Top 0.305: U2.2 6.35,25.91 | C7.2 3.72,24.42 | U2.10 11.56,25.91
  Top 0.406: C4.+ 2.4,41.26 1.91,40.77 1.91,24.89 2.37,24.42 C7.2 | 3.72,24.42 5.21,25.91 6.35,25.91 11.56,25.91 19.3,25.91 20.32,24.89 20.32,18.03 20.57,17.78 JP2.4 21.84,17.78
  Top 0.61: C4.+ IC2.3
  Bottom 0.254: v24.89,6.73 25.27,6.35 37.78,6.35 R1.2
+5V  (via drill 0.4, 0.6)
  Top 0.254: U$2.4 17.38,73.3 v17.4,73.28 | U$2.19 22.3,71.7 v22.1,71.5 | v29.34,57.66 C6.1 | v16.76,47.12 IC3.3
  Top 0.305: U2.19 6.35,29.34 v5.59,28.57
  Top 0.406: C3.+ 6.97,41.26 6.48,40.77 6.48,35.05 3.56,32.13 C8.2 3.72,30.44 v5.59,28.57 | U$2.4 10.94,73.3 10.67,73.03 9.91,73.03 9.27,73.66 9.27,80.39 8.64,81.03 v4.06,81.03
  Top 0.61: v5.97,44.83 13.08,44.83
  Top 1.016: C3.+ 13.08,44.83 IC3.3
  Bottom 0.254: C24.2 8.64,6.35 9.14,5.84 38.1,5.84 38.86,6.6 40.39,6.6 41.53,7.75 R18.2 | v17.4,73.28 17.78,72.9 C5.2 18.71,72.82 C16.1 21.72,71.12 v22.1,71.5 | v29.34,57.66 29.21,57.53 IC1.8 25.02,57.53 24.77,57.28 24.77,49.53 | 24.77,49.53 25.27,49.02 R24.1 | 24.77,49.53 22.35,47.12 v16.76,47.12
  Bottom 0.406: v5.59,28.57 5.59,21.21 7.11,19.68 7.11,16.38 8.47,15.03 C24.2 8.8,15.03 10.67,16.89 12.95,16.89 13.34,17.27 U$1.3
  Bottom 0.61: TDB-05.+ 24.26,94.12 D5.K | C1.2 TDB-05.+ | TDB-05.+ 10.79,92.58 ISP.2 4.06,85.85 v4.06,81.03 4.06,56.9 2.29,55.12 2.29,46.35 3.81,44.83 v5.97,44.83
ADC1/12V-AKKU/SCK_A  (via drill 0.4)
  Top 0.254: ISP.7 14.35,85.98 16.13,85.98 16.89,85.22 16.89,84.2 13.72,81.03 13.72,78.74 19.16,73.3 U$2.12 19.16,65.26 18.67,64.77 18.67,57.02 v19.43,56.26 R2.2
  Bottom 0.254: R2.2 v19.43,56.26
ADC2/12V-EXT  (via drill 0.4)
  Top 0.254: U$2.13 19.96,65.3 19.18,64.52 19.18,58.8 v19.43,58.55 R10.2
  Bottom 0.254: v19.43,58.55 R10.2
ADC3/I-12V  (via drill 0.4)
  Top 0.254: U$2.14 20.76,65.33 19.68,64.26 19.68,61.91 R13.2 20.89,60.64 21.84,59.69 v27.3,59.69
  Bottom 0.254: v27.3,59.69 29.21,59.69 31.37,57.53 IC1.1
ADC5/I-AKT  (via drill 0.4)
  Top 0.254: U$2.16 22.36,66.29 22.48,66.17 22.48,64.9 | 22.48,64.9 21.21,63.63 21.21,63.56 R19.2 | v43.94,56.26 43.43,55.75 35.05,55.75 34.04,56.77 34.04,60.45 33.66,60.83 29.59,60.83 26.29,64.14 24.51,64.14 23.75,64.9 22.48,64.9
  Bottom 0.254: IC11.IS 44.33,58.93 43.94,58.55 v43.94,56.26
ADC6/I-MOT
  Top 0.254: U$2.26 21.56,81.06 R20.2 30.71,82.23 IC4.4
ADC8/I-KICK
  Top 0.254: IC12.IS 43.69,61.21 42.93,60.45 42.93,57.02 42.42,56.52 35.31,56.52 34.8,57.02 34.8,60.83 34.16,61.47 29.84,61.47 27.69,63.63 27.69,66.29 26.74,67.24 R14.2 26.54,69.47 25.91,70.1 U$2.17
ADC9/24V
  Top 0.254: U$2.18 28.42,70.9 29.34,69.98 R11.1 R9.2
AKTUATOR  (via drill 0.4)
  Top 0.254: P6.3 50.49,62.15 52.96,59.69 52.96,57.91 54.74,56.13 66.04,56.13 66.67,55.5 66.67,20.07 66.29,19.68 v64.52,19.68 62.48,17.65 v62.48,16.76
  Bottom 0.254: v64.52,19.68 R_NULL_2.1 | R17.1 41.72,2.35 42.67,3.3 42.67,5.97 43.18,6.48 47.24,6.48 51.94,11.18 60.2,11.18 62.48,13.46 v62.48,16.76
  Bottom 0.813: IC11.OUT2 47.38,57.79 48.01,58.42 48.01,59.68 P6.3 50.31,62.35 IC11.OUT1
CANH
  Bottom 0.254: U$1.7 12.06,14.35 12.32,14.61 15.88,14.61 16.51,13.97 16.51,9.02 17.02,8.51 29.97,8.51 30.35,8.89 30.35,11.81 28.32,13.84 28.32,14.16 R6.1 28.13,18.99 28.65,19.5 RJ_2.P$2
CANL
  Bottom 0.254: RJ_2.P$3 34.04,15.25 SJ1.1 33.78,14.1 33.78,13.72 32.26,12.19 32.26,8.76 31.5,8 14.99,8 13.34,9.65 U$1.6
CLKOUT_ETH  (via drill 0.4)
  Top 0.254: v9.78,33.66 9.78,32.13 9.6,31.95 U2.14 | U$2.30 18.36,79.18 v18.03,79.5
  Bottom 0.254: v9.78,33.66 8.64,34.8 8.64,78.99 9.14,79.5 v18.03,79.5
CLKOUT_ETH_3V
  Top 0.254: U2.7 9.6,22.78 10.67,21.72 18.29,21.72 18.67,21.34 18.67,17.02 20.32,15.37 20.32,11.81 21.97,10.16 JP2.1
CS_ETH  (via drill 0.4)
  Top 0.254: U2.13 10.26,31.85 10.67,32.26 v10.67,32.89 | U$2.32 16.76,78.24 16.51,78.49 v15.62,78.49
  Bottom 0.254: v10.67,32.89 10.67,34.04 9.14,35.56 9.14,77.98 9.65,78.49 v15.62,78.49
CS_ETH_3V
  Top 0.254: U2.8 10.26,22.89 10.92,22.23 18.67,22.23 19.18,21.72 19.18,17.27 20.83,15.62 20.83,13.84 21.97,12.7 JP2.2
DIV-24V
  Bottom 0.254: VR7.2 59.37,54.54 60.2,55.37 60.2,57.25 VR8.2 59.1,63.61 R37.1 | 59.61,63.61 59.69,63.69
  Bottom 0.406: 60.45,63.69 60.45,89.66 58.55,91.57 39.62,91.57 38.8,90.74 VR9.2 | R37.1 59.69,63.69 60.45,63.69 | 60.45,63.69 R36.2
DIV-AKKU  (via drill 0.4)
  Top 0.254: R35.1 50.93,25.72 v50.93,23.24 50.93,21.86 VR3.2
  Bottom 0.254: R30.2 50.72,21.65 VR3.2 50.93,21.86 v50.93,23.24 50.93,23.62
DIV-EXT
  Bottom 0.254: R46.2 52.92,21.65 VR2.2 52.77,25.27 R45.1 57.19,26.99 VR1.2
GND  (via drill 0.4)
  other vias: 27.43,69.98 24.77,65.41 25.91,49.91 47.62,8 12.7,28.57 3.56,22.61 21.72,72.64 17.27,71.12 64.52,21.08 50.29,18.41 24.13,62.74 46.23,38.73 46.23,35.94
  pour Bottom: 0,99.82 69.98,99.82 69.98,0 0,0
  pour Top: 0,99.82 69.98,99.82 69.98,0 0,0
INT_ETH  (via drill 0.4)
  Top 0.254: U2.20 v5.71,32.89 | U$2.27 20.76,81.22 v20.32,81.66
  Bottom 0.254: v5.71,32.89 5.71,34.04 6.99,35.31 7.11,79.76 9.53,82.17 19.81,82.17 v20.32,81.66
INT_ETH_3V
  Top 0.254: U2.1 5.71,22.61 3.43,20.32 JP1.5
KICKER  (via drill 0.4)
  Top 0.254: 50.31,57.79 50.67,57.79 52.83,55.63 65.79,55.63 66.17,55.24 66.17,26.54 v65.66,26.04
  Top 0.813: IC12.OUT1 50.31,57.79 P6.4 48.01,60.47 48.01,61.72 47.38,62.35 IC12.OUT2
  Bottom 0.254: R23.1 43.88,2.35 44.96,1.27 47.12,1.27 47.75,1.91 47.75,5.46 52.45,10.16 60.71,10.16 62.61,12.06 | 63.64,10.94 R_NULL_1.1 63.36,11.32 62.61,12.06 | 62.61,12.06 65.66,15.11 v65.66,26.04
LED_BLAU
  Bottom 0.254: R4.2 SV2.9
LED_GELB
  Bottom 0.254: R_NULL_2.2 58.93,19.68 SV2.5
LED_GRUEN
  Bottom 0.254: SV2.7 58.93,17.14 61.07,17.14 R_NULL_4.2
LED_ROT
  Bottom 0.254: R_NULL_3.2 58.93,22.23 SV2.3
MISO  (via drill 0.4)
  Top 0.254: U2.17 7.67,32.08 7.49,32.26 7.49,38.23 8.38,39.12 14.99,39.12 v15.37,39.5 | v11.56,68.83 12.82,70.1 U$2.8
  Bottom 0.254: v15.37,39.5 15.37,52.96 11.18,57.15 11.18,68.45 v11.56,68.83
MISO_3V
  Top 0.254: U2.4 7.67,23.04 5.08,20.45 5.08,16.89 3.43,15.24 JP1.3
MISO_A
  Top 0.254: U$2.1 13.46,75.7 13.08,76.07 13.08,82.17 ISP.9
MOSI  (via drill 0.4)
  Top 0.254: U2.16 8.31,32.21 8,32.51 8,37.97 8.64,38.61 16,38.61 v16.38,38.99 | v13.08,68.58 13.11,68.61 U$2.9
  Bottom 0.254: v16.38,38.99 16.38,39.62 15.88,40.13 15.88,53.21 11.68,57.4 11.68,67.18 v13.08,68.58
MOSI_3V
  Top 0.254: U2.5 8.31,22.91 5.59,20.19 5.59,14.86 3.43,12.7 JP1.2
MOSI_A
  Top 0.254: U$2.2 13.49,74.9 12.57,75.82 12.57,82.17 12.19,82.55 7.87,82.55 ISP.1
MOTION  (via drill 0.4)
  Top 0.254: v64.52,18.16 66.8,18.16 67.18,18.54 67.18,86.23 61.85,91.57 53.99,91.57 P8.3
  Top 5: IC4.1 50.48,86.51 | 50.48,86.51 50.49,86.49 | IC4.5 42.92,76.31 P8.4 P8.3 50.48,88.06 50.48,86.51
  Bottom 0.254: R15.1 46.29,2.35 47.24,3.3 47.24,5.71 52.2,10.67 60.45,10.67 63.39,13.6 R_NULL_4.1 v64.52,18.16
N$1
  Bottom 0.254: R5.2 27.12,88.44 T1.1
N$2
  Bottom 0.254: VR1.1 Q7.C
N$3  (via drill 0.4)
  Top 0.254: EXT.A v46.1,11.05
  Bottom 0.254: v46.1,11.05 R25.2
N$4  (via drill 0.4)
  Top 0.254: KICK.A v43.81,5.59
  Bottom 0.254: v43.81,5.59 R23.2
N$5  (via drill 0.4)
  Top 0.254: 3V3.A v39.24,11.05
  Bottom 0.254: v39.24,11.05 R1.1
N$6
  Bottom 0.254: U$1.8 R31.2
N$7
  Bottom 0.254: R6.2 SJ1.2
N$8
  Top 0.254: VR3.1 52.77,21.65 51.82,20.7 49.11,20.7 Q6.C
N$9
  Bottom 0.254: D2.A 48.31,26.99 R7.2
N$10
  Top 0.254: U$2.11 18.36,67.13 17.78,66.55 7.28,66.55 C10.2 3.21,66.84 3.17,66.8 Q1.2
N$11
  Top 0.254: U$2.10 17.56,67.34 17.27,67.06 8.64,67.06 8.13,67.56 8.13,71.97 C11.2 3.21,73.11 3.17,73.15 Q1.1
N$12
  Bottom 0.254: R26.2 50.99,25.78 47.88,25.78 46.35,24.26 D1.A
N$13  (via drill 0.4)
  Top 0.254: v21.84,74.42 21.84,73.66 22.21,73.3 U$2.21
  Bottom 0.254: C14.2 21.59,74.68 v21.84,74.42
N$20
  Bottom 0.61: T1.3 29.17,89.87 TDB-05.- 31.88,94.12 D5.A
N$22
  Top 1.016: F1.2 19.56,50.8 18.16,52.2 IC3.1 9.53,52.2 | 9.53,52.2 IC2.1 | C2.+ 9.16,52.56 9.53,52.2
N$24  (via drill 0.4)
  Top 0.254: AKKU.A v43.81,11.05
  Bottom 0.254: v43.81,11.05 R28.2
N$25  (via drill 0.4)
  Top 0.254: R21.2 v24.13,60.83 27.81,60.83 28.32,60.33 28.32,53.47 v28.96,52.83
  Bottom 0.254: R21.2 v24.13,60.83 | IC1.2 29.34,56.26 28.96,55.88 v28.96,52.83 28.96,51.75 R22.1
N$26
  Bottom 0.254: R22.2 R24.2 30.41,46.12 D4.3
N$28
  Top 1.422: Q3.S Q2.S
N$30
  Top 0.254: Q4.G 46.1,22.76 Q6.E
  Bottom 0.254: Q4.G 43.12,28.07 R42.2
  Bottom 0.406: Q5.G Q4.G
N$31
  Bottom 1.422: Q5.S Q4.S
N$36  (via drill 0.4)
  Top 0.254: IC12.IN 45.09,58.93 44.7,58.55 44.7,57.28 v45.85,56.13
  Bottom 0.254: v45.85,56.13 58.78,56.13 VR8.1
N$37
  Bottom 0.254: VR9.1 38.29,92.64 37.34,91.69 37.34,90.17 34.09,86.92 IC4.2
N$40
  Bottom 0.254: IC11.IN 43.56,61.21 42.93,60.58 42.93,56.01 43.56,55.37 56.52,55.37 57.02,54.86 57.02,53.47 57.85,52.64 VR7.1
N$49
  Bottom 0.254: Q2.G 43.5,41.53 R34.2
  Bottom 0.406: Q3.G Q2.G 46.86,41.53 49.4,44.07 52.07,44.07 53.72,42.42 53.72,32.38 55.37,30.73 61.61,30.73 Q7.E
N$102  (via drill 0.4)
  Top 0.254: 12V.A v39.24,5.59
  Bottom 0.254: v39.24,5.59 R16.2
N$104  (via drill 0.4)
  Top 0.254: AKT.A v41.53,5.59
  Bottom 0.254: v41.53,5.59 R17.2
N$106  (via drill 0.4)
  Top 0.254: MOT.A v46.1,5.59
  Bottom 0.254: v46.1,5.59 R15.2
N$108  (via drill 0.4)
  Top 0.254: 5V.A v41.53,11.05
  Bottom 0.254: v41.53,11.05 R18.1
RST
  Top 0.254: ISP.5 11.94,86.11 11.94,88.39 12.7,89.15 16.51,89.15 17.53,88.14 17.53,83.57 17.02,83.06 17.02,78.99 17.56,78.45 U$2.31
RST_ETH  (via drill 0.4)
  Top 0.254: U2.12 10.92,31.75 11.56,32.38 v11.56,33.66 | U$2.3 10.34,74.1 v10.29,74.04
  Bottom 0.254: v11.56,33.66 11.56,33.91 9.65,35.81 9.65,73.41 9.97,73.72 v10.29,74.04
RST_ETH_3V
  Top 0.254: U2.9 10.92,22.99 11.18,22.73 19.05,22.73 19.68,22.1 19.68,17.53 21.97,15.24 JP2.3
RXCAN  (via drill 0.4)
  Top 0.254: U$2.7 12.22,70.9 v11.94,70.61
  Bottom 0.254: U$1.4 14.61,27.94 12.95,29.59 12.95,34.29 10.67,36.58 10.67,69.34 v11.94,70.61
SCK  (via drill 0.4)
  Top 0.254: U2.15 8.97,32.08 8.94,32.08 8.89,32.13 v8.89,32.89 | U$2.28 19.96,79.99 v19.81,80.14
  Bottom 0.254: v8.89,32.89 8.13,33.66 8.13,79.25 8.89,80.01 17.27,80.01 17.65,80.39 19.56,80.39 v19.81,80.14
SCK_3V
  Top 0.254: JP1.1 3.43,10.16 4.57,11.3 4.57,13.08 6.1,14.61 6.1,19.94 8.97,22.81 U2.6
SPEAKER  (via drill 0.4)
  Top 0.254: U$2.25 22.36,79.13 v22.73,79.5
  Bottom 0.254: v22.73,79.5 28.83,85.6 28.83,86.05 R5.1
SW_12V  (via drill 0.4)
  Top 0.254: Q6.B 48.96,21.65 48.01,20.7 v45.21,20.7 | U$2.22 31.31,74.1 v31.37,74.04 | SV2.4 61.47,22.23 61.47,27.81 v60.2,29.08 58.67,30.61 58.67,46.1 60.83,48.26 60.83,53.34 60.2,53.98 52.96,53.98 v52.58,53.59
  Bottom 0.254: D2.K 45.34,18.65 | 45.34,18.65 D1.K 47.48,17.53 54.86,17.53 57.02,19.68 58.04,19.68 59.31,20.95 SV2.4 | v45.21,20.7 45.21,18.78 45.34,18.65 | v31.37,74.04 34.54,70.87 34.54,56.64 37.21,53.98 51.05,53.98 51.44,53.59 v52.58,53.59 | v60.2,29.08 61.11,29.08 Q7.B
SW_AKT  (via drill 0.4)
  Top 0.254: U$2.23 31.91,74.9 v32.64,74.17 | SV2.6 61.98,20.19 61.98,28.45 59.18,31.24 59.18,45.72 61.34,47.88 61.34,53.59 | 61.34,53.59 60.45,54.48 v51.82,54.48 | 61.34,53.59 v62.99,53.59
  Bottom 0.254: VR7.3 v62.99,53.59 SJ2.1 | v32.64,74.17 35.05,71.75 35.05,56.9 37.47,54.48 v51.82,54.48
SW_BLAU  (via drill 0.4)
  Top 0.254: U$2.15 21.56,65.82 v21.59,65.79 | SV2.10 59.05,14.48 59.05,29.34 58.17,30.23 58.17,46.35 60.33,48.51 60.33,53.09 59.94,53.47 54.1,53.47 v53.34,52.7
  Bottom 0.254: v21.59,65.79 23.75,63.63 33.53,63.63 34.04,63.12 34.04,56.39 36.96,53.47 50.67,53.47 51.44,52.7 v53.34,52.7
SW_KICK
  Bottom 0.254: VR8.3 62.99,57.4 SJ2.2
SW_MOT  (via drill 0.4)
  Top 0.254: U$2.24 23.86,78.47 v25.15,79.76
  Top 0.406: v67.94,16.51 67.31,15.88 SV2.8
  Bottom 0.254: 36.24,91.61 VR9.3 36.24,90.85 v25.15,79.76
  Bottom 0.406: v67.94,16.51 67.94,85.47 56.77,96.65 40.39,96.65 36.24,92.5 VR9.3
TXCAN  (via drill 0.4)
  Top 0.254: v10.54,70.61 11.63,71.7 U$2.6
  Bottom 0.254: U$1.1 10.79,27.94 12.45,29.59 12.45,34.04 10.16,36.32 10.16,70.23 v10.54,70.61
WOL_ETH  (via drill 0.4)
  Top 0.254: v6.6,33.66 6.6,32.38 7.01,31.98 U2.18 | v18.54,81.28 18.92,80.9 18.92,78.74 19.16,78.5 U$2.29
  Bottom 0.254: v6.6,33.66 7.62,34.67 7.62,79.5 9.4,81.28 v18.54,81.28
WOL_ETH_3V
  Top 0.254: U2.3 7.01,23.14 4.57,20.7 4.57,18.92 3.43,17.78 JP1.4

### Text on the board
tNames: CNC PowerSwitch / 2016 v0.95 / info@das-lab.net
Document: Speaker